# EAGLE schematic Transmissor nano (EAGLE 9.6.2)
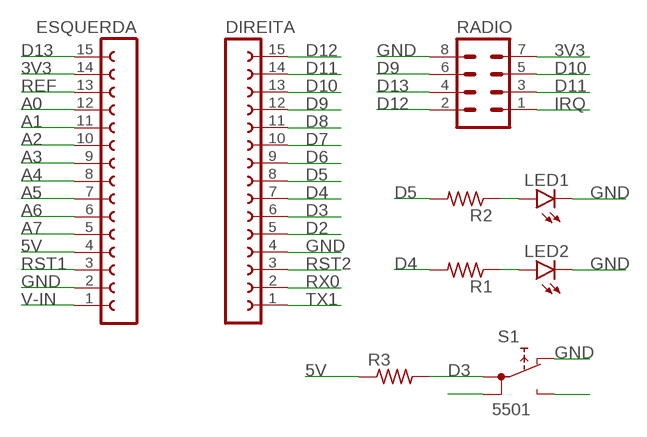
[diagram p0: schematic, sheet 1]

## Parts
DIREITA  FE15-1  [FE15]
ESQUERDA  FE15-1  [FE15]
LED1  LED5MM  [LED5MM]
LED2  LED5MM  [LED5MM]
R1  R-US_0204/7  [0204/7]
R2  R-US_0204/7  [0204/7]
R3  R-US_0204/7  [0204/7]
RADIO  MA04-2  [MA04-2]
S1  5501  [5501]

## Nets
3V3: ESQUERDA.14 RADIO.7
5V: ESQUERDA.4 R3.1
A0: ESQUERDA.12
A1: ESQUERDA.11
A2: ESQUERDA.10
A3: ESQUERDA.9
A4: ESQUERDA.8
A5: ESQUERDA.7
A6: ESQUERDA.6
A7: ESQUERDA.5
D2: DIREITA.5
D3: DIREITA.6 R3.2 S1.1A
D4: DIREITA.7 R1.2
D5: DIREITA.8 R2.2
D6: DIREITA.9
D7: DIREITA.10
D8: DIREITA.11
D9: DIREITA.12 RADIO.6
D10: DIREITA.13 RADIO.5
D11: DIREITA.14 RADIO.3
D12: DIREITA.15 RADIO.2
D13: ESQUERDA.15 RADIO.4
GND: DIREITA.4 ESQUERDA.2 LED1.K(C) LED2.K(C) RADIO.8 S1.NC
IRQ: RADIO.1
N$1: LED1.A R2.1
N$2: LED2.A R1.1
N$8: S1.1B
N$10: S1.NO
REF: ESQUERDA.13
RST1: ESQUERDA.3
RST2: DIREITA.3
RX0: DIREITA.2
TX1: DIREITA.1
V-IN: ESQUERDA.1

## Library data of the parts
DIREITA ESQUERDA = con-lsta:FE15-1: FEMALE HEADER; OC_FARNELL: unknown; OC_NEWARK: unknown
LED1 LED2 = led:LED: LED OSRAM: - CHIPLED LG R971, LG N971, LY N971, LG Q971, LY Q971, LO R971, LY R971 LH N974, LH R974 LS Q976, LO Q976, LY Q976 LO Q996 - Hyper CHIPLED LW Q18S LB Q993, LB Q99A, LB R99A - SideLED LS A670, LO A670, LY A670, LG A670, LP A670 LB A673, LV A673, LT A673, LW A673 LH A674 LY A675 LS A676, LA A676, LO A676, LY A676, LW A676 LS A679, LY A679, LG A679 - Hyper Micro SIDELED® LS Y876, LA Y876, LO Y876, LY Y876 LT Y87S - SmartLED LW L88C, LW L88S LB L89C, LB L89S, LG L890 LS L89K, LO L89K, LY L89K LS L896, LA L896, LO L896, LY L896 - TOPLED LS T670, LO T670, LY T670, LG T670, LP T670 LSG T670, LSP T670, LSY T670, LOP T670, LYG T670 LG T671, LOG T671, LSG T671 LB T673, LV T673, LT T673, LW T673 LH T674 LS T676, LA T676, LO T676, LY T676, LB T676, LH T676, LSB T676, LW T676 LB T67C, LV T67C, LT T67C, LS T67K, LO T67K, LY T67K, LW E67C LS E67B, LA E67B, LO E67B, LY E67B, LB E67C, LV E67C, LT E67C LW T67C LS T679, LY T679, LG T679 LS T770, LO T770, LY T770, LG T770, LP T770 LB T773, LV T773, LT T773, LW T773 LH T774 LS E675, LA E675, LY E675, LS T675 LS T776, LA T776, LO T776, LY T776, LB T776 LHGB T686 LT T68C, LB T68C - Hyper Mini TOPLED® LB M676 - Mini TOPLED Santana® LG M470 LS M47K, LO M47K, LY M47K Source: http://www.osram.convergy.de LUXEON: - LUMILED® LXK2-PW12-R00, LXK2-PW12-S00, LXK2-PW14-U00, LXK2-PW14-V00 LXK2-PM12-R00, LXK2-PM12-S00, LXK2-PM14-U00 LXK2-PE12-Q00, LXK2-PE12-R00, LXK2-PE12-S00, LXK2-PE14-T00, LXK2-PE14-U00 LXK2-PB12-K00, LXK2-PB12-L00, LXK2-PB12-M00, LXK2-PB14-N00, LXK2-PB14-P00, LXK2-PB14-Q00 LXK2-PR12-L00, LXK2-PR12-M00, LXK2-PR14-Q00, LXK2-PR14-R00 LXK2-PD12-Q00, LXK2-PD12-R00, LXK2-PD12-S00 LXK2-PH12-R00, LXK2-PH12-S00 LXK2-PL12-P00, LXK2-PL12-Q00, LXK2-PL12-R00 Source: www.luxeon.com KINGBRIGHT: KA-3528ASYC Source: www.kingbright.com
R1-R3 = rcl:R-US_: RESISTOR, American symbol; SPICEPREFIX: R
RADIO = con-lstb:MA04-2: PIN HEADER; OC_FARNELL: unknown; OC_NEWARK: unknown
S1 = switch:55?: PUSHBUTTON SERIES 5500 SWITCHES Source: www.e-switch.com .. 5500.pdf